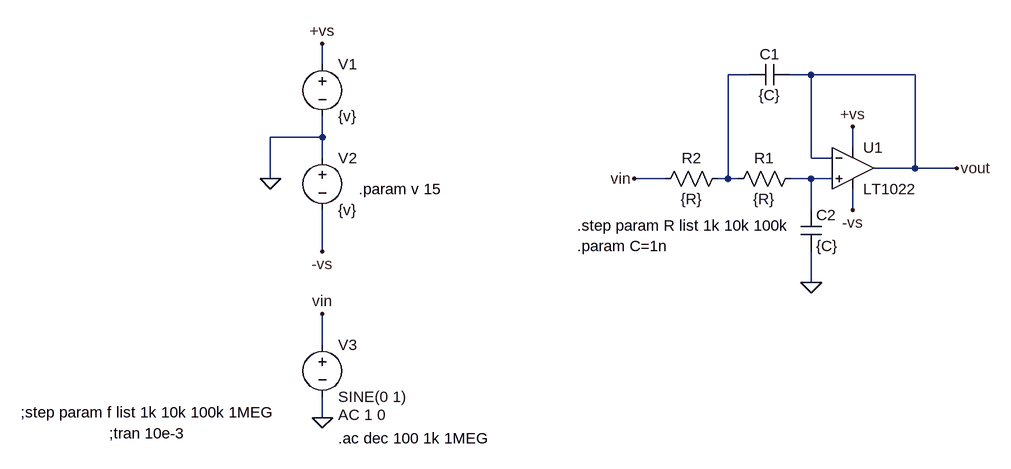
[diagram p0: schematic Draft1.asc]
Draft1.asc, the LTspice schematic file:
Version 4
SHEET 1 880 680
WIRE -432 0 -432 -32
WIRE 224 16 192 16
WIRE 320 16 288 16
WIRE 480 16 320 16
WIRE -432 112 -432 80
WIRE -432 112 -512 112
WIRE 384 128 384 96
WIRE -432 144 -432 112
WIRE 320 144 320 16
WIRE 352 144 320 144
WIRE 480 160 480 16
WIRE 480 160 416 160
WIRE 544 160 480 160
WIRE -512 176 -512 112
WIRE 96 176 48 176
WIRE 192 176 192 16
WIRE 192 176 176 176
WIRE 208 176 192 176
WIRE 320 176 288 176
WIRE 352 176 320 176
WIRE 320 224 320 176
WIRE 384 224 384 192
WIRE -432 288 -432 224
WIRE 320 336 320 288
WIRE -432 432 -432 384
WIRE -432 544 -432 512
FLAG -512 176 0
FLAG -432 -32 +vs
FLAG -432 288 -vs
FLAG 384 96 +vs
FLAG 384 224 -vs
FLAG -432 544 0
FLAG -432 384 vin
FLAG 48 176 vin
FLAG 544 160 vout
FLAG 320 336 0
SYMBOL OpAmps\\LT1022 384 96 R0
SYMATTR InstName U1
SYMBOL voltage -432 -16 R0
WINDOW 123 0 0 Left 0
WINDOW 39 0 0 Left 0
SYMATTR InstName V1
SYMATTR Value {v}
SYMBOL voltage -432 128 R0
WINDOW 123 0 0 Left 0
WINDOW 39 0 0 Left 0
SYMATTR InstName V2
SYMATTR Value {v}
SYMBOL res 304 160 R90
WINDOW 0 0 56 VBottom 2
WINDOW 3 32 56 VTop 2
SYMATTR InstName R1
SYMATTR Value {R}
SYMBOL res 192 160 R90
WINDOW 0 0 56 VBottom 2
WINDOW 3 32 56 VTop 2
SYMATTR InstName R2
SYMATTR Value {R}
SYMBOL cap 288 0 R90
WINDOW 0 0 32 VBottom 2
WINDOW 3 32 32 VTop 2
SYMATTR InstName C1
SYMATTR Value {C}
SYMBOL voltage -432 416 R0
WINDOW 123 24 124 Left 2
WINDOW 39 0 0 Left 0
SYMATTR Value2 AC 1 0
SYMATTR InstName V3
SYMATTR Value SINE(0 1)
SYMBOL cap 304 224 R0
SYMATTR InstName C2
SYMATTR Value {C}
TEXT -376 192 Left 2 !.param v 15
TEXT -40 280 Left 2 !.param C=1n
TEXT -40 248 Left 2 !.step param R list 1k 10k 100k
TEXT -896 536 Left 2 !;step param f list 1k 10k 100k 1MEG
TEXT -408 576 Left 2 !.ac dec 100 1k 1MEG
TEXT -760 568 Left 2 !;tran 10e-3

The netlist it stands for:
* Draft1.asc
XU1 N002 vout +vs -vs vout LT1022  ; pins In+ In- V+ V- OUT
V1 +vs 0 {v}
V2 0 -vs {v}
R1 N002 N001 {R}
R2 N001 vin {R}
C1 vout N001 {C}
V3 vin 0 SINE(0 1) AC 1 0
C2 N002 0 {C}
.param v 15
.param C=1n
.step param R list 1k 10k 100k
;step param f list 1k 10k 100k 1MEG
.ac dec 100 1k 1MEG
;tran 10e-3
.backanno
.end